# EAGLE schematic ESP32 (EAGLE 9.5.1)

## Sheet 1 of 6
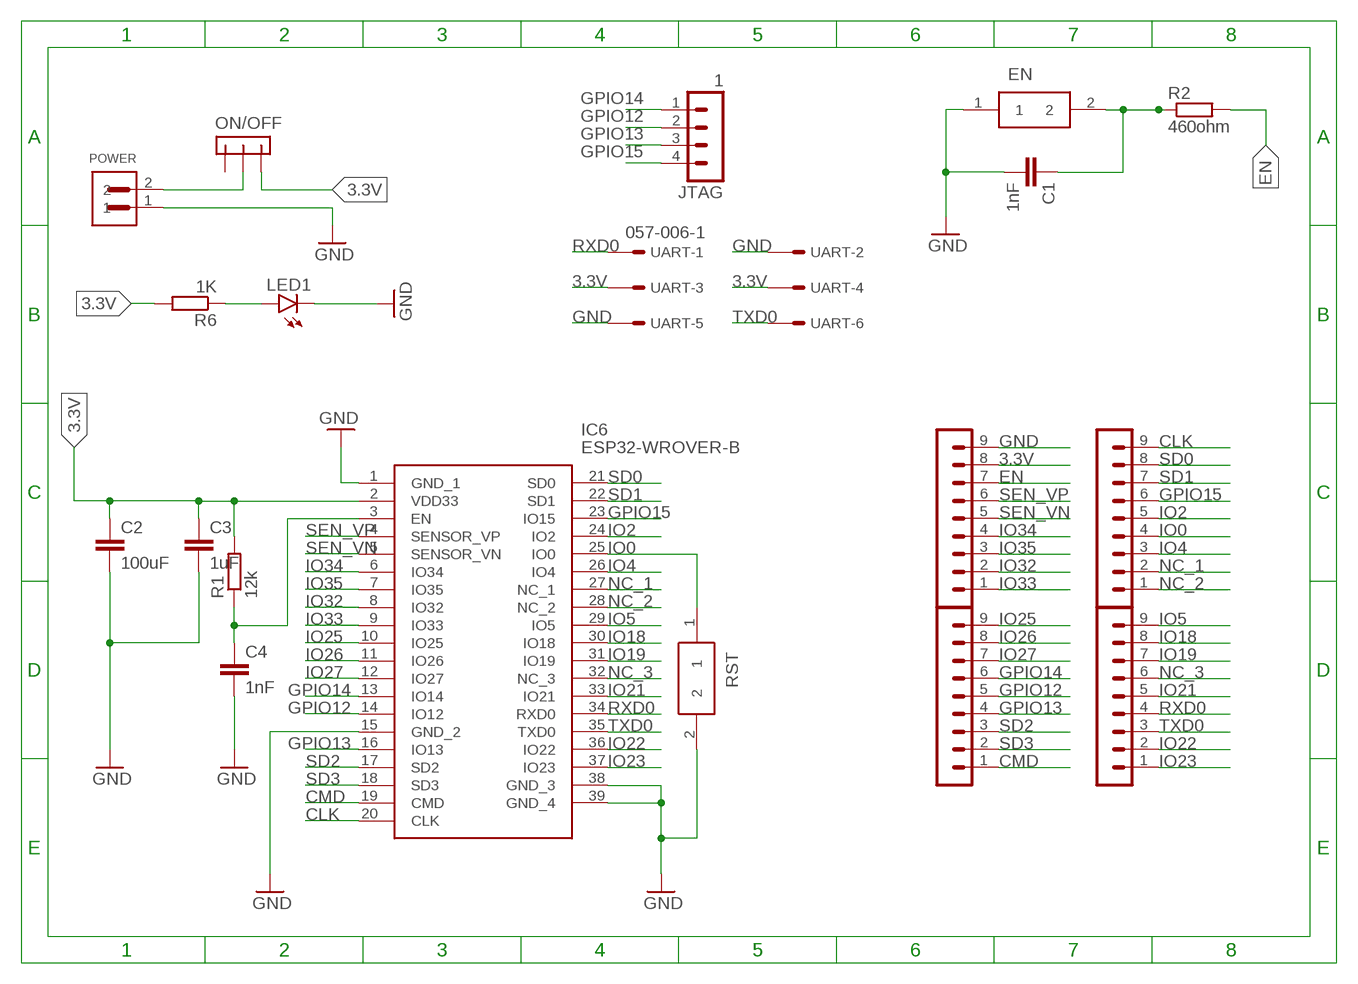
[diagram p0: schematic, sheet 1]

### Parts
C1  1nF  C-EU_805C0805  [C0805]
C2  100uF  C-EU_1206C1206  [C1206]
C3  1uF  C-EU_805C0805  [C0805]
C4  1nF  C-EU_805C0805  [C0805]
EN  FSMSMTR  [FSMSM]
IC6  ESP32-WROVER-B  [ESP32WROVERIB16MB]
JTAG  1  MA04-1  [MA04-1]
LED1  LEDSMT1206  [1206]
ON/OFF  -CON3  [CON3]
POWER  S2B-PH-SM4-TB  [JST_S2B-PH-SM4-TB]
R1  12k  R-EU_805R0805  [R0805]
R2  460ohm  R-EU_805R0805  [R0805]
R6  1K  R-EU_R1206  [R1206]
RST  FSMSMTR  [FSMSM]
SV1  PINHEADER-1X9  [MA09-1]
SV2  PINHEADER-1X9  [MA09-1]
SV5  PINHEADER-1X9  [MA09-1]
SV6  PINHEADER-1X9  [MA09-1]
UART  057-006-1  [057-006-1]

### Nets
3.3V: C2.1 C3.1 IC6.2(VDD33) ON/OFF.P$1 R1.2 R6.2 SV5.8 UART.3 UART.4
CLK: IC6.20(CLK) SV1.9
CMD: IC6.19(CMD) SV6.1
EN [other]: C1.1 C4.1 EN.2 IC6.3(EN) R1.1 R2.1 R2.2 SV5.7
GND: C1.2 C2.2 C3.2 C4.2 EN.1 IC6.1(GND_1) IC6.15(GND_2) IC6.38(GND_3) IC6.39(GND_4) LED1.C POWER.1 RST.2 SV5.9 UART.2 UART.5
GPIO12: IC6.14(IO12) JTAG.2 SV6.5
GPIO13: IC6.16(IO13) JTAG.3 SV6.4
GPIO14: IC6.13(IO14) JTAG.1 SV6.6
GPIO15: IC6.23(IO15) JTAG.4 SV1.6
IO0 [other]: IC6.25(IO0) RST.1 SV1.4
IO2: IC6.24(IO2) SV1.5
IO4: IC6.26(IO4) SV1.3
IO5: IC6.29(IO5) SV2.9
IO18: IC6.30(IO18) SV2.8
IO19: IC6.31(IO19) SV2.7
IO21: IC6.33(IO21) SV2.5
IO22: IC6.36(IO22) SV2.2
IO23: IC6.37(IO23) SV2.1
IO25: IC6.10(IO25) SV6.9
IO26: IC6.11(IO26) SV6.8
IO27: IC6.12(IO27) SV6.7
IO32: IC6.8(IO32) SV5.2
IO33: IC6.9(IO33) SV5.1
IO34: IC6.6(IO34) SV5.4
IO35: IC6.7(IO35) SV5.3
N$1: ON/OFF.P$2 POWER.2
N$14 [other]: LED1.A R6.1
NC_1: IC6.27(NC_1) SV1.2
NC_2: IC6.28(NC_2) SV1.1
NC_3: IC6.32(NC_3) SV2.6
RXD0 [other]: IC6.34(RXD0) SV2.4 UART.1
SD0: IC6.21(SD0) SV1.8
SD1: IC6.22(SD1) SV1.7
SD2: IC6.17(SD2) SV6.3
SD3: IC6.18(SD3) SV6.2
SEN_VN: IC6.5(SENSOR_VN) SV5.5
SEN_VP: IC6.4(SENSOR_VP) SV5.6
TXD0 [other]: IC6.35(TXD0) SV2.3 UART.6
Unconnected: ON/OFF.P$3

## Sheet 2 of 6

## Sheet 3 of 6

## Sheet 4 of 6

## Sheet 5 of 6

## Sheet 6 of 6

## Library data of the parts
C1 C3 C4 = CommonParts:C-EU_805: CAPACITOR, European symbol; SPICEPREFIX: C
C2 = CommonParts:C-EU_1206: CAPACITOR, European symbol; SPICEPREFIX: C
EN RST = FSMSMTR:FSMSMTR: Black Button Tact Switch, SPST 50 mA @ 24 V dc 1.07mm Source: Datasheet <http://www.te.com/commerce/DocumentDelivery/DDEController?Action=showdoc&DocId=Customer Drawing1437566-3C2pdfEnglishENG_CD_1437566-3_C2_1437566_3_1_c.dwg.pdf1437566-4>; ALLIED_NUMBER: 70286948; ALLIED_PRICE-STOCK: https://www.alliedelec.com/te-connectivity-fsmsmtr/70286948/; DESCRIPTION: Black Button Tact Switch, SPST 50 mA @ 24 V dc 1.07mm; HEIGHT: mm; MANUFACTURER_NAME: TE Connectivity; MANUFACTURER_PART_NUMBER: FSMSMTR; MOUSER_PART_NUMBER: 506-FSMSMTR; MOUSER_PRICE-STOCK: https://www.mouser.com/Search/Refine.aspx?Keyword=506-FSMSMTR; RS_PART_NUMBER: 1680547; RS_PRICE-STOCK: http://uk.rs-online.com/web/p/products/1680547
IC6 = ESP32-WROVER-B:ESP32-WROVER-B: WiFi Modules (802.11) SMD Module, ESP32-D0WD, 64Mbits PSRAM, 32Mbits SPI flash, PCB Antenna Source: Datasheet <https://www.espressif.com/sites/default/files/documentation/esp32-wrover-b_datasheet_en.pdf>; DESCRIPTION: WiFi Modules (802.11) SMD Module, ESP32-D0WD, 64Mbits PSRAM, 32Mbits SPI flash, PCB Antenna; HEIGHT: mm; MANUFACTURER_NAME: Espressif Systems; MANUFACTURER_PART_NUMBER: ESP32-WROVER-B; MOUSER_PART_NUMBER: 356-ESP32-WROVER-B; MOUSER_PRICE-STOCK: https://www.mouser.com/Search/Refine.aspx?Keyword=356-ESP32-WROVER-B
JTAG = con-lstb:MA04-1: PIN HEADER; OC_FARNELL: unknown; OC_NEWARK: unknown
LED1 = led:LED: LED OSRAM: - CHIPLED LG R971, LG N971, LY N971, LG Q971, LY Q971, LO R971, LY R971 LH N974, LH R974 LS Q976, LO Q976, LY Q976 LO Q996 - Hyper CHIPLED LW Q18S LB Q993, LB Q99A, LB R99A - SideLED LS A670, LO A670, LY A670, LG A670, LP A670 LB A673, LV A673, LT A673, LW A673 LH A674 LY A675 LS A676, LA A676, LO A676, LY A676, LW A676 LS A679, LY A679, LG A679 - Hyper Micro SIDELED® LS Y876, LA Y876, LO Y876, LY Y876 LT Y87S - SmartLED LW L88C, LW L88S LB L89C, LB L89S, LG L890 LS L89K, LO L89K, LY L89K LS L896, LA L896, LO L896, LY L896 - TOPLED LS T670, LO T670, LY T670, LG T670, LP T670 LSG T670, LSP T670, LSY T670, LOP T670, LYG T670 LG T671, LOG T671, LSG T671 LB T673, LV T673, LT T673, LW T673 LH T674 LS T676, LA T676, LO T676, LY T676, LB T676, LH T676, LSB T676, LW T676 LB T67C, LV T67C, LT T67C, LS T67K, LO T67K, LY T67K, LW E67C LS E67B, LA E67B, LO E67B, LY E67B, LB E67C, LV E67C, LT E67C LW T67C LS T679, LY T679, LG T679 LS T770, LO T770, LY T770, LG T770, LP T770 LB T773, LV T773, LT T773, LW T773 LH T774 LS E675, LA E675, LY E675, LS T675 LS T776, LA T776, LO T776, LY T776, LB T776 LHGB T686 LT T68C, LB T68C - Hyper Mini TOPLED® LB M676 - Mini TOPLED Santana® LG M470 LS M47K, LO M47K, LY M47K Source: http://www.osram.convergy.de LUXEON: - LUMILED® LXK2-PW12-R00, LXK2-PW12-S00, LXK2-PW14-U00, LXK2-PW14-V00 LXK2-PM12-R00, LXK2-PM12-S00, LXK2-PM14-U00 LXK2-PE12-Q00, LXK2-PE12-R00, LXK2-PE12-S00, LXK2-PE14-T00, LXK2-PE14-U00 LXK2-PB12-K00, LXK2-PB12-L00, LXK2-PB12-M00, LXK2-PB14-N00, LXK2-PB14-P00, LXK2-PB14-Q00 LXK2-PR12-L00, LXK2-PR12-M00, LXK2-PR14-Q00, LXK2-PR14-R00 LXK2-PD12-Q00, LXK2-PD12-R00, LXK2-PD12-S00 LXK2-PH12-R00, LXK2-PH12-S00 LXK2-PL12-P00, LXK2-PL12-Q00, LXK2-PL12-R00 Source: www.luxeon.com KINGBRIGHT: KA-3528ASYC Source: www.kingbright.com
ON/OFF = tango:-CON3
POWER = S2B-PH-SM4-TB:S2B-PH-SM4-TB: CONN HEADER PH SIDE 2POS 2MM SMD; AVAILABILITY: Unavailable; DESCRIPTION: Socket; wire-board; male; PIN: 2; 2mm; SMT; PH; 100V; 2A; -25÷85°C; MF: JST Sales; MP: S2B-PH-SM4-TB; PACKAGE: None; PRICE: None
R1 R2 = CommonParts:R-EU_805: RESISTOR, European symbol
R6 = rcl:R-EU_: RESISTOR, European symbol; SPICEPREFIX: R
SV1 SV2 SV5 SV6 = CommonParts:PINHEADER-1X9: PIN HEADER; OC_FARNELL: unknown; OC_NEWARK: unknown
UART = con-panduit:057-006-: CONNECTOR 6-pin series 057 contact pc board low profile headers; OC_FARNELL: unknown; OC_NEWARK: unknown

## Net classes
1 other: width 0.2 mm, drill 0.2 mm, clearance 0.1 mm